# EAGLE design geiger (EAGLE 7.6.0)
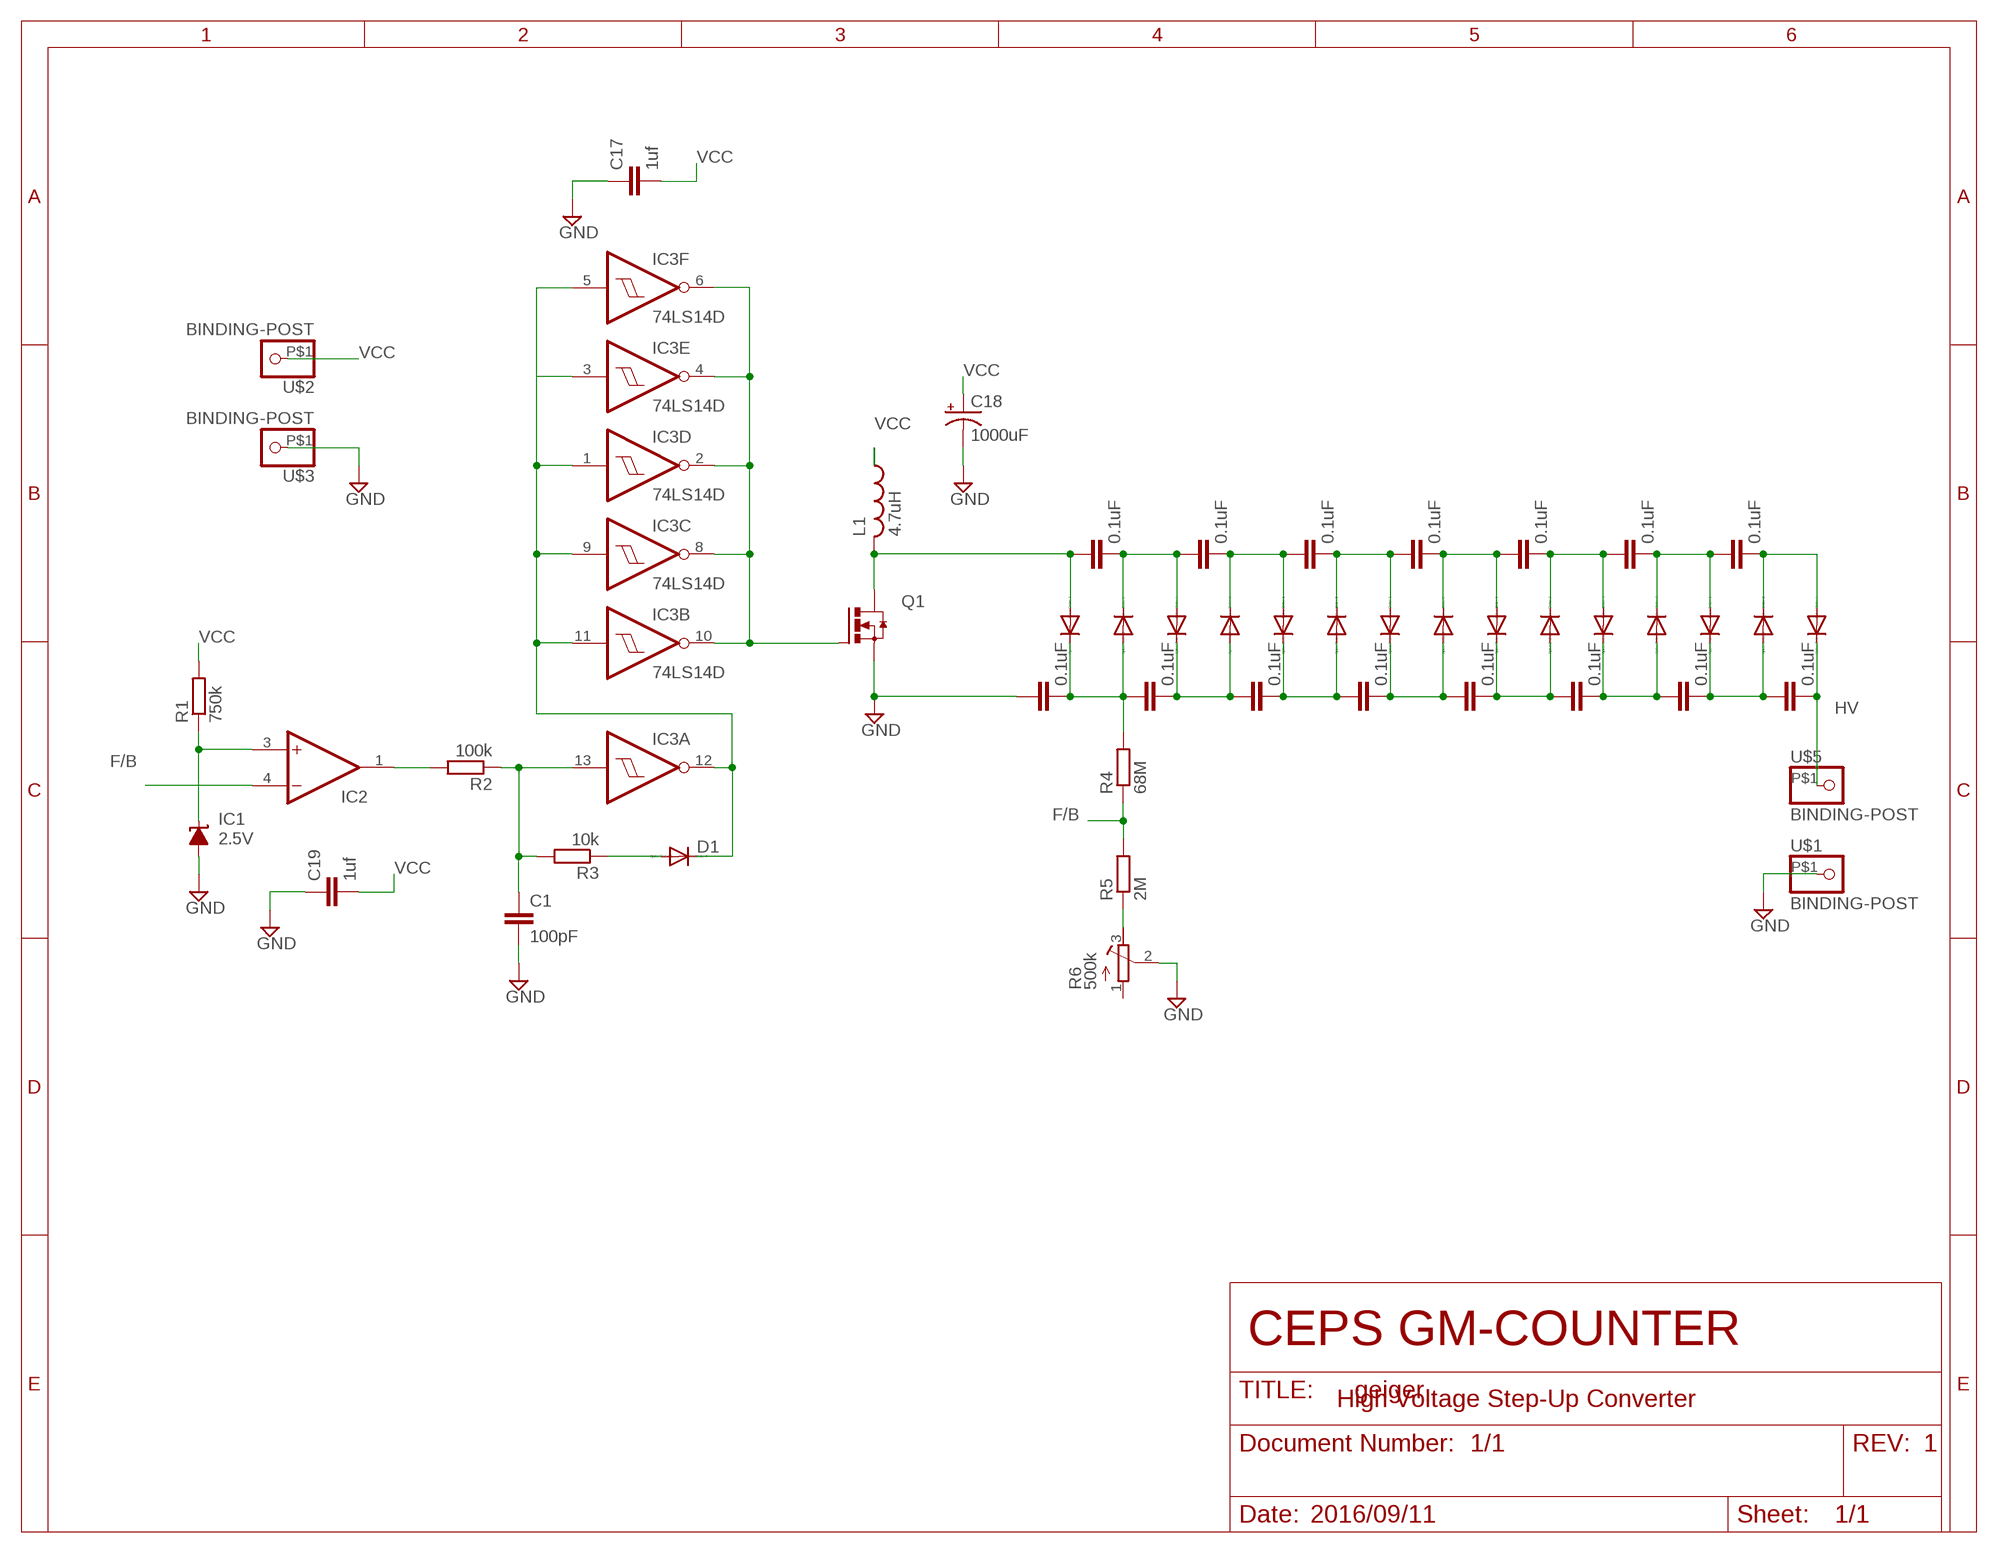
[diagram p0: schematic, sheet 1]

## Parts
C1  100pF  C-EUC0603  [C0603]
C2  0.1uF  C-EUC0603  [C0603]
C3  0.1uF  C-EUC0603  [C0603]
C4  0.1uF  C-EUC0603  [C0603]
C5  0.1uF  C-EUC0603  [C0603]
C6  0.1uF  C-EUC0603  [C0603]
C7  0.1uF  C-EUC0603  [C0603]
C8  0.1uF  C-EUC0603  [C0603]
C9  0.1uF  C-EUC0603  [C0603]
C10  0.1uF  C-EUC0603  [C0603]
C11  0.1uF  C-EUC0603  [C0603]
C12  0.1uF  C-EUC0603  [C0603]
C13  0.1uF  C-EUC0603  [C0603]
C14  0.1uF  C-EUC0603  [C0603]
C15  0.1uF  C-EUC0603  [C0603]
C16  0.1uF  C-EUC0603  [C0603]
C17  1uf  C-EUC0603  [C0603]
C18  1000uF  CPOL-USTT5D10  [TT5D10]
C19  1uf  C-EUC0603  [C0603]
D1  1N4148DO35-7  [DO35-7]
D2  1N4148DO35-7  [DO35-7]
D3  1N4148DO35-7  [DO35-7]
D4  1N4148DO35-7  [DO35-7]
D5  1N4148DO35-7  [DO35-7]
D6  1N4148DO35-7  [DO35-7]
D7  1N4148DO35-7  [DO35-7]
D8  1N4148DO35-7  [DO35-7]
D9  1N4148DO35-7  [DO35-7]
D10  1N4148DO35-7  [DO35-7]
D11  1N4148DO35-7  [DO35-7]
D12  1N4148DO35-7  [DO35-7]
D13  1N4148DO35-7  [DO35-7]
D14  1N4148DO35-7  [DO35-7]
D15  1N4148DO35-7  [DO35-7]
D16  1N4148DO35-7  [DO35-7]
IC1  2.5V  LM4041A12DBZ  [DBZ_R-PDSO-G3]
IC2  MAX4105EUK  [SOT23-5L]
IC3  74LS14D  [SO14]
L1  4.7uH  L-US6000-XXX-RC  [6000-XXXX-RC]
Q1  N-HEXFET-2D_SOT232-IRLL2705  [SOT223]
R1  750k  R-EU_R0603  [R0603]
R2  100k  R-EU_R0603  [R0603]
R3  10k  R-EU_R0603  [R0603]
R4  68M  R-EU_R0603  [R0603]
R5  2M  R-EU_R0603  [R0603]
R6  500k  R-TRIMM4G/J  [RTRIM4G/J]
U$1  BINDING-POST  [BINDING-POST]
U$2  BINDING-POST  [BINDING-POST]
U$3  BINDING-POST  [BINDING-POST]
U$5  BINDING-POST  [BINDING-POST]

## Nets
+HV: C15.2 D15.C D16.A
F/B: IC2.4(-IN) R4.1 R5.2
GND: C1.2 C2.1 C17.1 C18.- C19.1 IC1.2(A) Q1.3(S) R6.2(S) U$1.P$1 U$3.P$1
HV: C16.2 D16.C U$5.P$1
N$1: IC1.1(C) IC2.3(+IN) R1.1
N$2: D1.A R3.1
N$3: IC2.1(OUT) R2.2
N$4: C1.1 IC3.13(A:I) R2.1 R3.2
N$5: D1.C IC3.1(D:I) IC3.3(E:I) IC3.5(F:I) IC3.9(C:I) IC3.11(B:I) IC3.12(A:O)
N$6: IC3.2(D:O) IC3.4(E:O) IC3.6(F:O) IC3.8(C:O) IC3.10(B:O) Q1.1(G)
N$7: C2.2 C4.1 D2.C D3.A R4.2
N$8: C4.2 C6.1 D4.C D5.A
N$10: C3.2 C5.1 D3.C D4.A
N$11: R5.1 R6.3(E)
N$12: C5.2 C7.1 D5.C D6.A
N$13: C6.2 C8.1 D6.C D7.A
N$14: C7.2 C9.1 D7.C D8.A
N$15: C8.2 C10.1 D8.C D9.A
N$16: C9.2 C11.1 D9.C D10.A
N$17: C11.2 C13.1 D11.C D12.A
N$18: C13.2 C15.1 D13.C D14.A
N$21: C14.2 C16.1 D14.C D15.A
N$22: C12.2 C14.1 D12.C D13.A
N$23: C10.2 C12.1 D10.C D11.A
N$24: C3.1 D2.A L1.2 Q1.2(D) Q1.4(D)
VCC: C17.2 C18.+ C19.2 L1.1 R1.2 U$2.P$1
Unconnected: R6.1(A)

## Notes on the sheet
- CEPS GM-COUNTER
- High Voltage Step-Up Converter
- 1/1 | 1
- 2016/09/11

## Power pins joined to a net without a drawn wire
GND: IC3.7(P:GND)
VCC: IC2.5(VCC) IC3.14(P:VCC)
VEE: IC2.2(VEE)

## Library data of the parts
C1-C17 C19 = rcl:C-EU: CAPACITOR, European symbol
C18 = rcl:CPOL-US: POLARIZED CAPACITOR, American symbol
D1-D16 = diode:1N4148: DIODE high speed (Philips)
IC1 = texas:LM4041: PRECISION MICROPOWER SHUNT VOLTAGE REFERENCE Source: http://focus.ti.com/lit/ds/slcs146e/slcs146e.pdf; MPN: LM4041A12IDBZR; OC_FARNELL: 1407949; OC_NEWARK: 58K5875
IC2 = maxim:MAX4105EUK: OP AMP; MPN: MAX4105EUK+T; OC_FARNELL: unknown; OC_NEWARK: 67K5152
IC3 = 74xx-us:74*14: Hex schmitt trigger INVERTER
L1 = rcl:L-US: INDUCTOR, American symbol
Q1 = transistor-power:N-HEXFET-2D_?-*: HEXFET® Power MOSFET 2 Drain connects http://www.irf.com/product-info/datasheets/data/irll014n.pdf
R1-R5 = resistor:R-EU_: RESISTOR, European symbol
R6 = rcl:R-TRIMM: Trimm resistor
U$1-U$3 U$5 = geiger:BINDING-POST

## Board
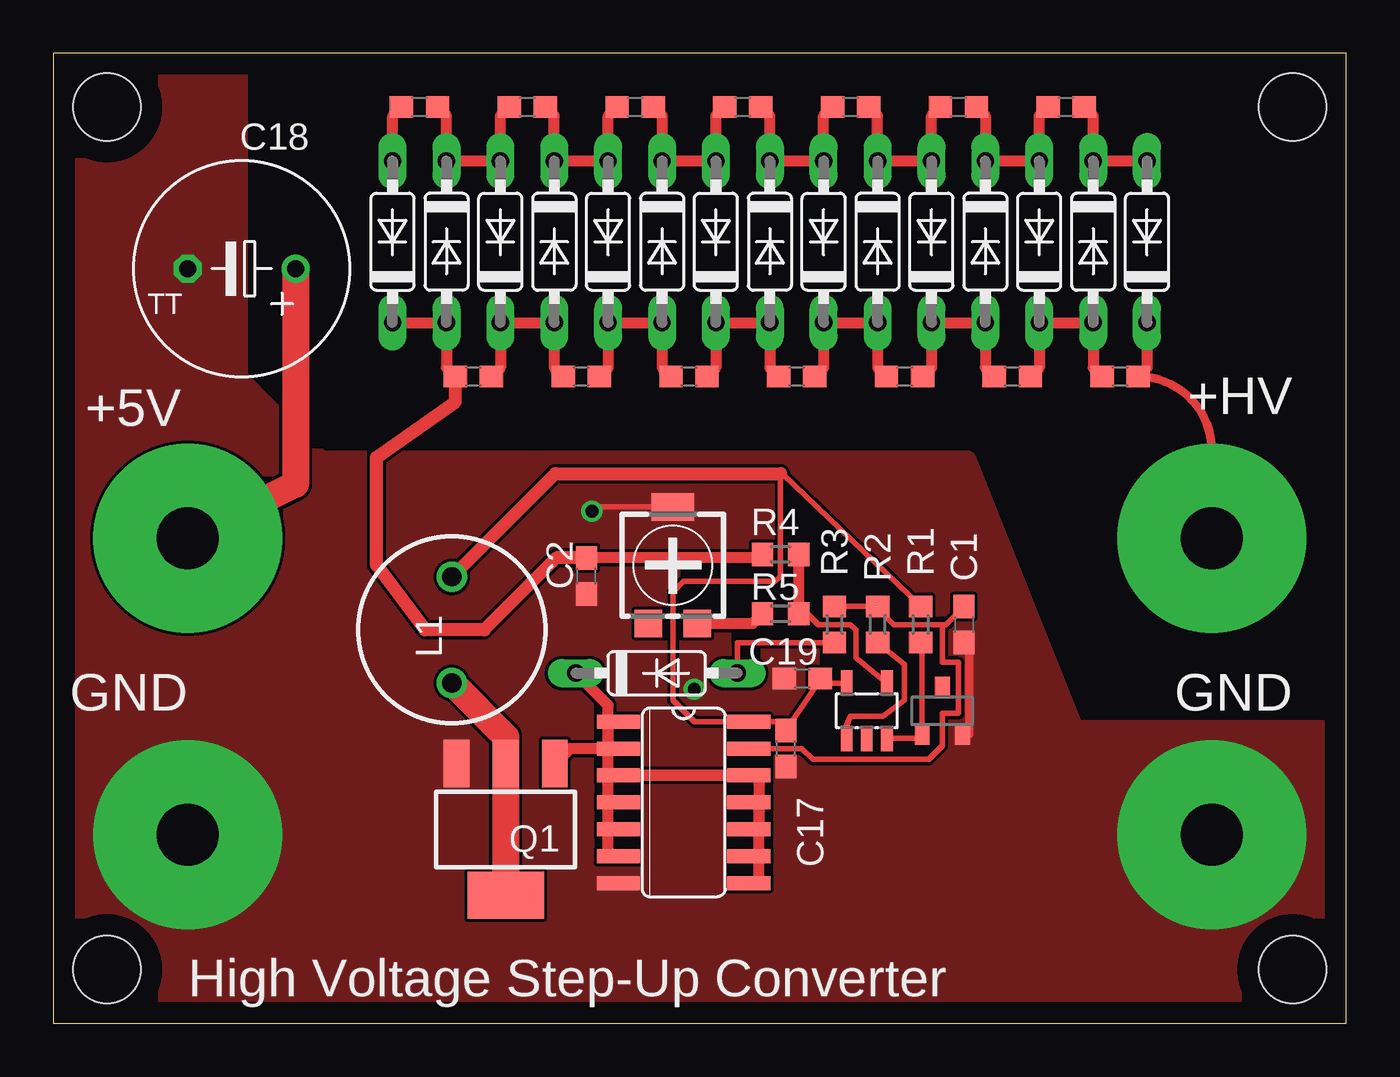
[diagram p1: board, top side]
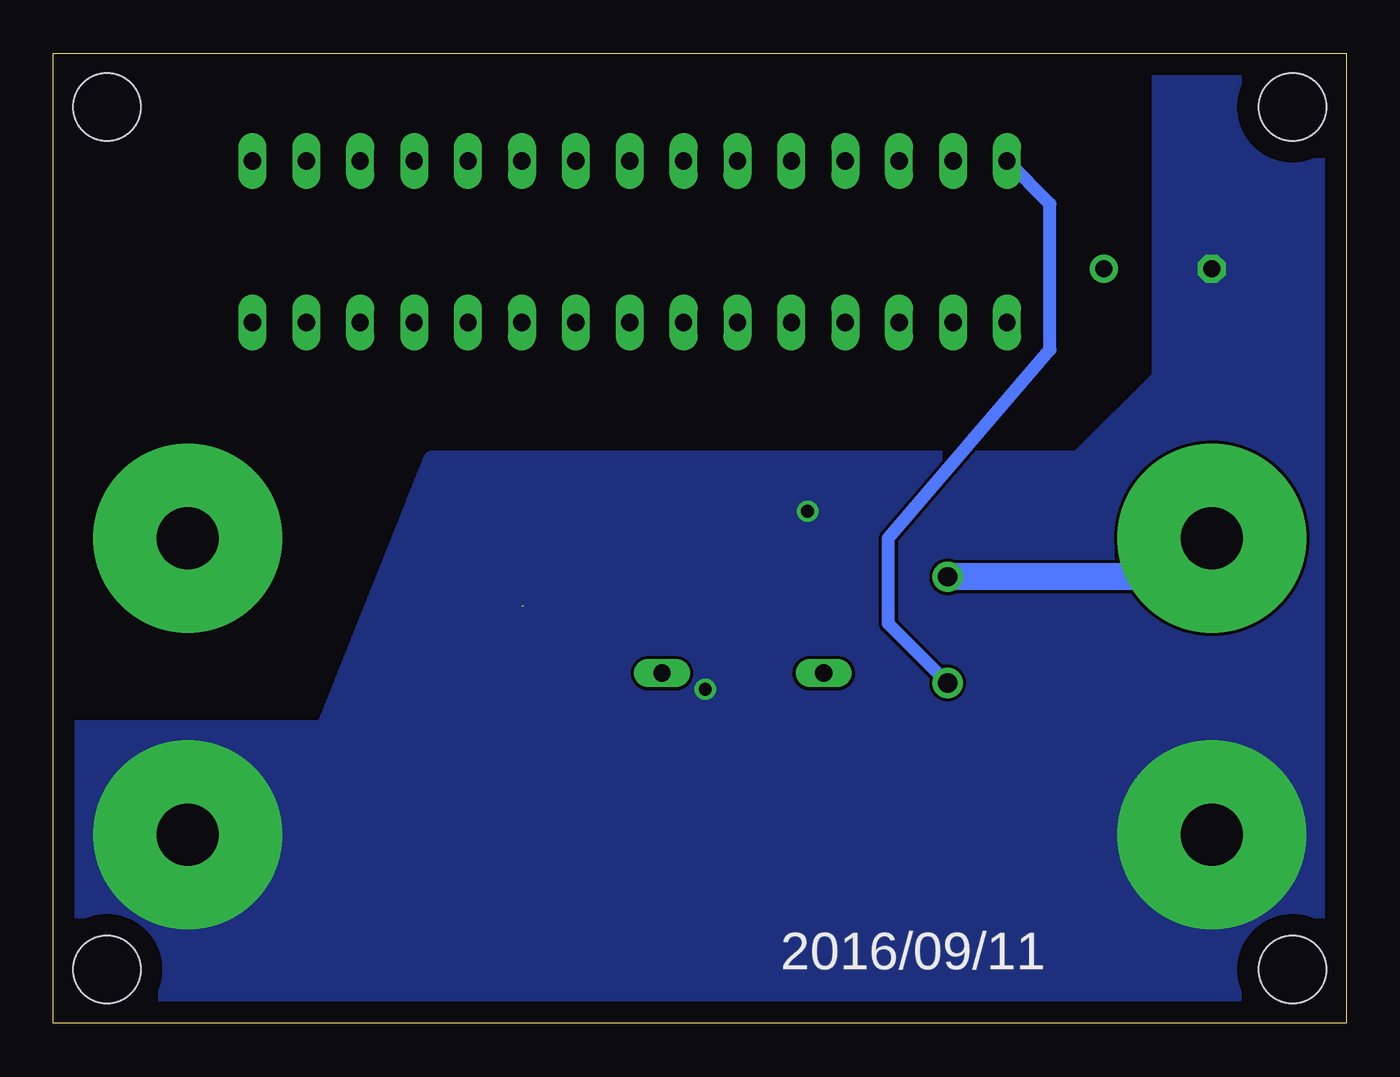
[diagram p2: board, bottom side, seen from below]

Size 60.96 x 45.72 mm. Coordinates in mm from the lower left corner, seen from the top.
Outline: 0,0 60.96,0 60.96,45.72 0,45.72 0,0
Copper layers (1*16): Top 0.035mm / dielectric 1.5mm / Bottom 0.035mm
Design rules "default *": minimum track width 10mil, minimum drill 24mil, track to track 6mil, track to pad 6mil, pad to pad 8mil, via to via 8mil, smd to smd 8mil, copper to edge 40mil, drill to drill 8mil, minimum pad ring 10mil, minimum via ring 8mil, stop-mask expansion 4mil, vias tented up to drill 0mil, thermal gap 10mil
Holes 3.17 mm at 2.54,2.54 58.42,2.54 58.42,43.18 2.54,43.18

### Footprints (pad centres in the part's own frame; a part is rotated, then mirrored left to right if it is on the bottom)
C0603 = smd 1.1 x 1: 1 -0.85,0; 2 0.85,0
TT5D10 = drill 0.813: + -2.54,0 | drill 0.813 octagon: - 2.54,0
DO35-7 = drill 0.813 long: A 3.81,0; C -3.81,0
DBZ_R-PDSO-G3 = smd 0.7 x 1: 1 -0.95,-1.1; 2 0.95,-1.1; 3 0,1.1
SOT23-5L = smd 0.55 x 1.2: 1 -0.95,-1.3; 2 0,-1.3; 3 0.95,-1.3; 4 0.95,1.3; 5 -0.95,1.3
SO14 = smd 0.66 x 2.032: 1 -3.81,-3.073; 2 -2.54,-3.073; 3 -1.27,-3.073; 4 0,-3.073; 5 1.27,-3.073; 6 2.54,-3.073; 7 3.81,-3.073; 8 3.81,3.073; 9 2.54,3.073; 10 1.27,3.073; 11 0,3.073; 12 -1.27,3.073; 13 -2.54,3.073; 14 -3.81,3.073
6000-XXXX-RC = drill 0.9 pad 1.422: 1 -2.5,0; 2 2.5,0
SOT223 = smd 1.219 x 2.235: 1 -2.311,-3.099; 2 0,-3.099; 3 2.311,-3.099 | smd 3.6 x 2.2: 4 0,3.099
R0603 = smd 1 x 1.1: 1 -0.85,0; 2 0.85,0
RTRIM4G/J = smd 1.3 x 1.3: 1 -1.15,-2.75; 3 1.15,-2.75 | smd 2 x 1.3: 2 0,2.75
BINDING-POST = drill 2.921 pad 8.89: P$1 0,0

### Placement (x,y rotation side)
C1  42.93,18.8 270 top
C2  25.15,21.08 90 top
C3  17.27,43.18 0 top
C4  19.81,30.48 0 top
C5  22.35,43.18 0 top
C6  24.89,30.48 0 top
C7  27.43,43.18 0 top
C8  29.97,30.48 0 top
C9  32.51,43.18 0 top
C10  35.05,30.48 0 top
C11  37.59,43.18 0 top
C12  40.13,30.48 0 top
C13  42.67,43.18 0 top
C14  45.21,30.48 0 top
C15  47.75,43.18 0 top
C16  50.29,30.48 0 top
C17  34.54,12.95 90 top
C18  8.89,35.56 180 top
C19  35.31,16.26 0 top
D1  28.45,16.51 0 top
D2  16,36.83 90 top
D3  18.54,36.83 270 top
D4  21.08,36.83 90 top
D5  23.62,36.83 270 top
D6  26.16,36.83 90 top
D7  28.7,36.83 270 top
D8  31.24,36.83 90 top
D9  33.78,36.83 270 top
D10  36.32,36.83 90 top
D11  38.86,36.83 270 top
D12  41.4,36.83 90 top
D13  43.94,36.83 270 top
D14  46.48,36.83 90 top
D15  49.02,36.83 270 top
D16  51.56,36.83 90 top
IC1  41.91,14.73 0 top
IC2  38.35,14.73 0 top
IC3  29.72,10.41 270 top
L1  18.8,18.54 270 top
Q1  21.34,9.14 180 top
R1  40.89,18.8 90 top
R2  38.86,18.8 270 top
R3  36.83,18.8 90 top
R4  34.29,22.1 180 top
R5  34.29,19.3 0 top
R6  29.21,21.59 0 top
U$1  54.61,8.89 0 top
U$2  6.35,22.86 0 top
U$3  6.35,8.89 0 top
U$5  54.61,22.86 0 top

### Tracks (layer width: path | path; a pad name or v marks a point on that pad's centre or on a via)
+HV
  Top 0.508: C15.2 49.02,42.76 D15.C D16.A
F/B
  Top 0.254: IC2.4 37.85,17.24 37.85,18.54 37.59,18.8 36.07,18.8 35.56,19.3 R5.2
  Top 0.508: R4.1 R5.2
GND  (via drill 0.6)
  Top 0.254: R6.2 25.61,24.34 v25.4,24.13
  Top 0.406: IC1.2 43.18,13.63 43.18,17.78 42.93,17.78 C1.2
  other vias: 30.23,15.75
  pour Bottom (no thermals): -1.27,-1.27 -1.27,48.26 8.89,48.26 8.89,30.48 12.7,26.67 43.18,26.67 48.26,13.97 62.23,13.97 62.23,-1.27
  pour Top (no thermals): -1.27,48.26 -1.27,-1.27 62.23,-1.27 62.23,13.97 48.26,13.97 43.18,26.67 12.7,26.67 8.89,30.48 8.89,48.26
HV
  Top 0.406: C16.2 arc-90 54.61,27.01 U$5.P$1
  Top 0.508: D16.C 51.56,30.9 C16.2
N$1
  Top 0.254: IC2.3 40.76,13.43 IC1.1 40.96,17.88 R1.1
N$2
  Top 0.254: R3.1 32.26,17.95 D1.A
N$3
  Top 0.254: R2.2 40.13,16.93 40.13,15.24 39.12,14.48 37.59,14.48 37.4,14.04 IC2.1
N$4  (1 unrouted)
  Top 0.254: 32.77,12.95 IC3.13 35.31,12.95 35.81,12.45 41.27,12.45 41.91,13.08 41.91,14.61 42.67,14.61 42.67,17.02 41.91,17.02 41.91,18.8 | C1.1 42.08,18.8 41.91,18.8 | 41.91,18.8 39.62,18.8 38.77,19.65 R3.2
N$5
  Top 0.508: IC3.5 26.16,9.14 26.16,11.68 | 26.16,11.68 IC3.3 IC3.12 33.27,11.68 33.27,10.41 | 26.16,11.68 26.16,14.22 | 26.16,14.22 IC3.1 | IC3.9 33.27,7.87 33.27,10.41 | 33.27,10.41 IC3.11 | 26.16,14.22 26.16,14.99 D1.C
N$6
  Top 0.508: 26.16,8.13 26.42,7.87 IC3.6 26.16,7.87 26.16,8.13 | 26.16,10.41 26.16,11.68 | 26.16,11.68 26.16,12.95 | 26.16,12.95 IC3.2 | 26.16,8.13 26.16,10.41 | 26.16,10.41 IC3.4 | 26.67,14.22 26.16,14.22 26.16,12.95 | 26.16,12.95 24.36,12.95 Q1.1 | IC3.8 33.27,6.6 33.27,9.14 | 26.16,11.68 33.27,11.68 33.27,9.14 | 33.27,9.14 IC3.10
N$7
  Top 0.508: C4.1 18.54,30.9 D3.A D2.C | R4.2 33.27,21.93 C2.2
  Top 0.61: C2.2 23.71,21.93 20.32,18.54 17.53,18.54 15.24,21.59 15.24,26.67 18.96,29.3 C4.1
N$8
  Top 0.508: C4.2 21.08,30.9 D4.C D5.A 23.62,30.9 C6.1
N$10
  Top 0.508: C3.2 18.54,42.76 D3.C D4.A 21.08,42.76 C5.1
N$11
  Top 0.508: R5.1 32.98,18.84 R6.3
N$12
  Top 0.508: C5.2 23.62,42.76 D5.C D6.A 26.16,42.76 C7.1
N$13
  Top 0.508: C6.2 26.16,30.9 D6.C D7.A 28.7,30.9 C8.1
N$14
  Top 0.508: C7.2 28.7,42.76 D7.C D8.A 31.24,42.76 C9.1
N$15
  Top 0.508: C8.2 31.24,30.9 D8.C D9.A 33.78,30.9 C10.1
N$16
  Top 0.508: C9.2 33.78,42.76 D9.C D10.A 36.32,42.76 C11.1
N$17
  Top 0.508: C11.2 38.86,42.76 D11.C D12.A 41.4,42.76 C13.1
N$18
  Top 0.508: C13.2 43.94,42.76 D13.C D14.A 46.48,42.76 C15.1
N$21
  Top 0.508: C14.2 46.48,30.9 D14.C D15.A 49.02,30.9 C16.1
N$22
  Top 0.508: C12.2 41.4,30.9 D12.C D13.A 43.94,30.9 C14.1
N$23
  Top 0.508: C10.2 36.32,30.9 D10.C D11.A 38.86,30.9 C12.1
N$24
  Top 0.508: D2.A 16,42.66 arc-45 16.08,42.83 C3.1
  Top 1.27: L1.2 21.34,13.5 Q1.2 Q1.4
  Bottom 0.61: L1.2 21.59,18.84 21.59,22.86 13.97,31.75 13.97,38.61 D2.A
VCC
  Top 0.254: R1.2 34.38,25.91 34.29,25.91 34.29,21.08 34.04,20.83 29.72,20.83 29.21,20.32 29.21,15.24 30.23,14.22 IC3.14 34.12,14.22 C17.2 36.16,16.18 C19.2 36.38,16.03 IC2.5
  Top 0.508: 40.73,19.81 R1.2
  Top 0.61: L1.1 23.66,25.91 34.29,25.91
  Top 1.27: C18.+ 11.43,25.4 U$2.P$1
  Bottom 1.27: U$2.P$1 8.89,21.04 L1.1

### Text on the board
tNames: +HV | +5V | GND | GND | High Voltage Step-Up Converter
bNames: 2016/09/11